# Altium schematic sheet LPDDR4X_other.SchDoc
size A4; SheetNumber: 16; SheetTotal: 36
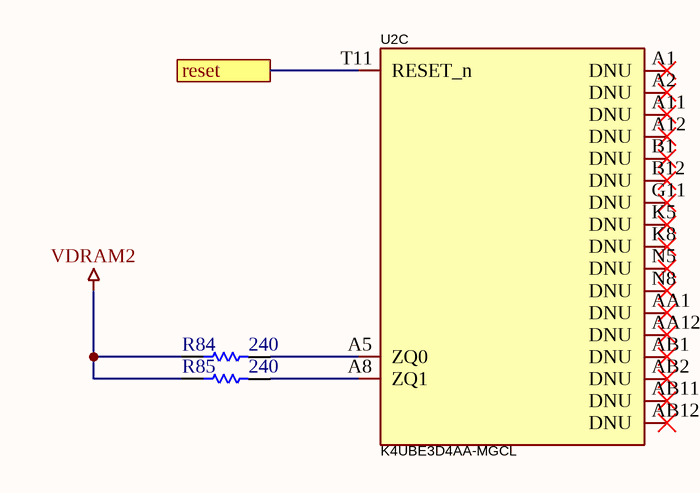
[diagram p0: LPDDR4X_other.SchDoc]

## Parts
R84  value 240  [R0603]  (hidden comment: R0603)
R85  value 240  [R0603]  (hidden comment: R0603)
U2  K4UBE3D4AA-MGCL  [K4F8E304HB-MGCJ]  (part C of 5)

## Ports
reset (see LPDDR4X[6000,2000], LPDDR4X[7000,2000], MT8365_LPDDR4X[880,4800])

## Nets
VDRAM2: R84.1 R85.1
reset: U2.T11(RESET_n) ; port reset
NetR84_2: R84.2 U2.A5(ZQ0)
NetR85_2: R85.2 U2.A8(ZQ1)

Not connected (* = marked no-connect by the designer): U2 A1(DNU)* A2(DNU)* A11(DNU)* A12(DNU)* AA1(DNU)* AA12(DNU)* AB1(DNU)* AB2(DNU)* AB11(DNU)* AB12(DNU)* B1(DNU)* B12(DNU)* G11(DNU)* K5(DNU)* K8(DNU)* N5(DNU)* N8(DNU)*

## Library data of the parts
U2 = K4UBE3D4AA-MGCL: Manufacturer: SAMSUNG(三星半导体); Add into BOM: yes; Memory Format: SDRAM LPDDR4X; Clock Frequency (fc): 2133MHz; Memory Size: 32Gbit; Supply Voltage: 1.7V~1.95V; Symbol: K4UBE3D4AA-MGCL; Device: K4UBE3D4AA-MGCL; LCSC Part Name: K4UBE3D4AA-MGCL 停产; Supplier Part: C2920257; Manufacturer Part: K4UBE3D4AA-MGCL; Supplier Footprint: FBGA-200; JLCPCB Part Class: Extended Part; Datasheet: https://atta.szlcsc.com/upload/public/pdf/source/20231024/5530CB18C2033A14DEC9B3A35E728586.pdf; Supplier: LCSC; Convert to PCB: yes; Supply current: -; Refresh Current: -; Operating Temperature: -25℃~+85℃